# Altium schematic sheet Schéma bloc.SchDoc: =SchTitle
size 276 x 198 mm; Organization: ETML; Address1: Rue de Sébeillon12; Address2: CH - 1004 Lausanne; Address3: Tél. 021 316 77 77; Address4: www.etml.ch; SheetNumber: 1; SheetTotal: 4; Replace: .; ModA: .; ModB: .; ModC: .; ModD: .
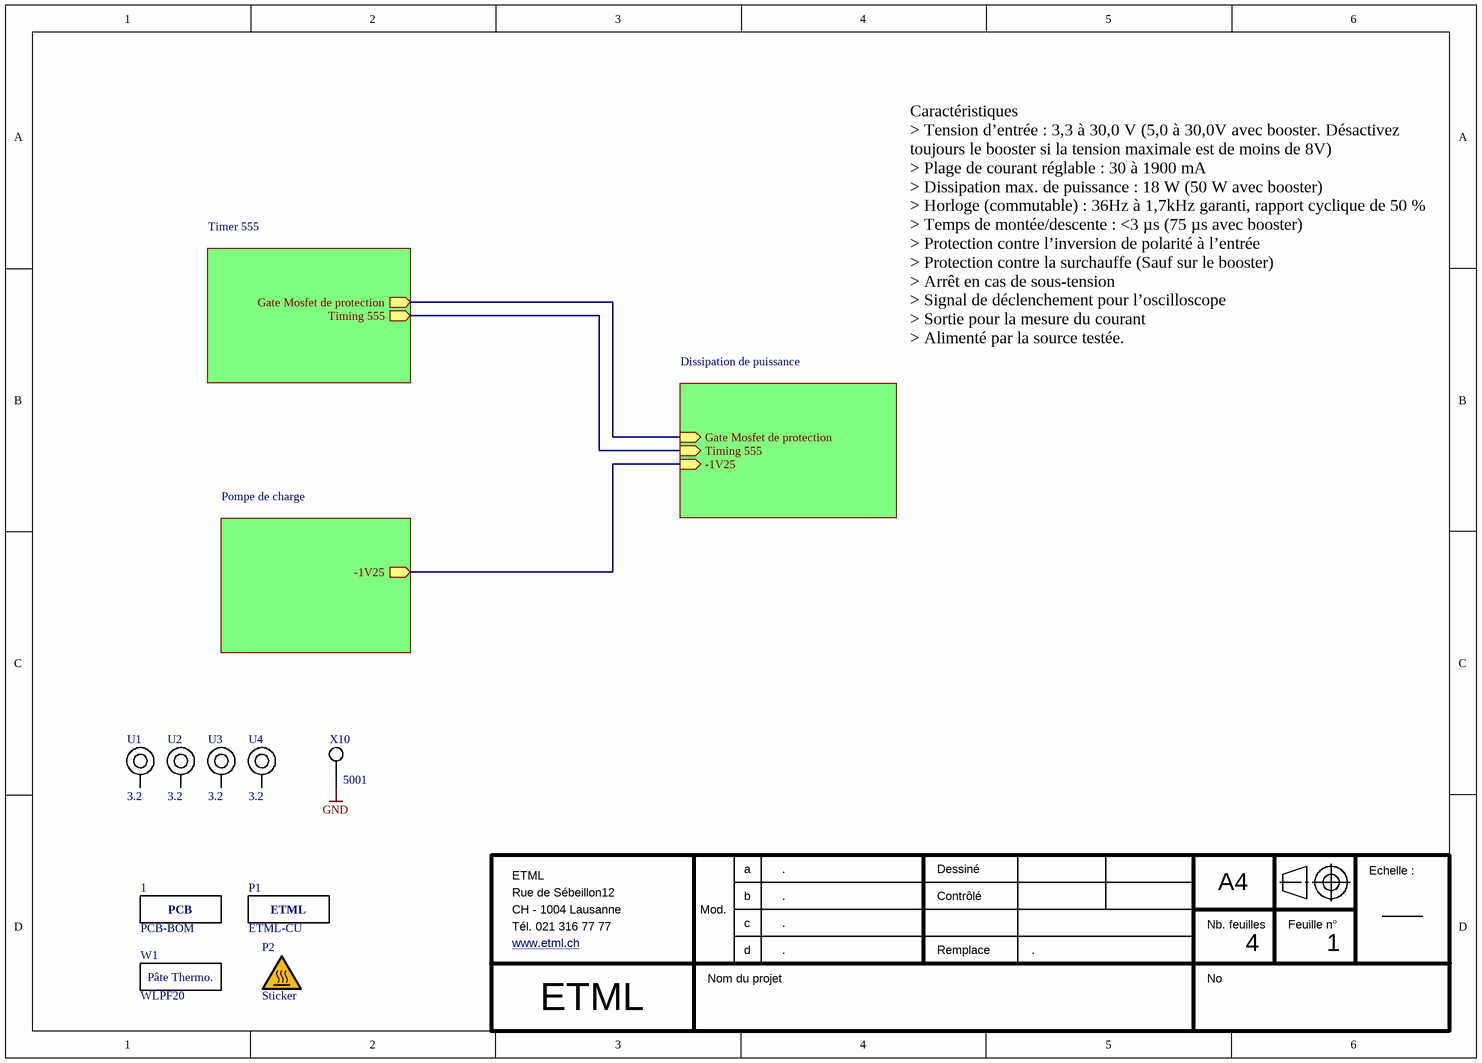
[diagram p0: Schéma bloc.SchDoc]

## Parts
1  PCB-BOM  (mechanical)
P1  ETML-CU  [DRAW-ETML-CU]  (no BOM)
P2  Sticker  [Sticker surface chaude]
U1  3.2  [MECH-PHD320]  (no BOM)
U2  3.2  [MECH-PHD320]  (no BOM)
U3  3.2  [MECH-PHD320]  (no BOM)
U4  3.2  [MECH-PHD320]  (no BOM)
W1  WLPF20
X10  5001  [Keystone_5001]

## Sub-sheets
Dissipation de puissance = Dissipation de puissance.SchDoc: Gate Mosfet de protection (in), Timing 555 (in), -1V25 (in)
Pompe de charge = Pompe de charge.SchDoc: -1V25 (out)
Timer 555 = Timer 555.SchDoc: Gate Mosfet de protection (out), Timing 555 (out)

## Nets
GND: X10.1(TP)
(unnamed): sheet Timer 555/Gate Mosfet de protection, sheet Dissipation de puissance/Gate Mosfet de protection
(unnamed): sheet Timer 555/Timing 555, sheet Dissipation de puissance/Timing 555
(unnamed): sheet Dissipation de puissance/-1V25, sheet Pompe de charge/-1V25

Not connected (* = marked no-connect by the designer): U1 1(PH); U2 1(PH); U3 1(PH); U4 1(PH)

## Notes on the sheet
- Caractéristiques
  > Tension d’entrée : 3,3 à 30,0 V (5,0 à 30,0V avec booster. Désactivez toujours le booster si la tension maximale est de moins de 8V)
  > Plage de courant réglable : 30 à 1900 mA
  > Dissipation max. de puissance : 18 W (50 W avec booster)
  > Horloge (commutable) : 36Hz à 1,7kHz garanti, rapport cyclique de 50 %
  > Temps de montée/descente : <3 µs (75 µs avec booster)
  > Protection contre l’inversion de polarité à l’entrée
  > Protection contre la surchauffe (Sauf sur le booster)
  > Arrêt en cas de sous-tension
  > Signal de déclenchement pour l’oscilloscope
  > Sortie pour la mesure du courant
  > Alimenté par la source testée.
- a
- Dessiné
- A4
- Echelle :
- Mod.
- b
- c
- d
- Contrôlé
- Remplace
- Nb. feuilles
- Feuille n°
- Nom du projet
- No
- (in symbol CMP-064-000000-1) ETML
- (in symbol CMP-064-000001-1) PCB
- (in symbol Graisse thermique) Pâte Thermo.

## Library data of the parts
1 = CMP-064-000001-1: PCB element for BOM; IsStocked: False; PN: 1438.5100.00; Category: Others; SubCategory: Dessins; Supplier Price 1: 52.05; Supplier 1: Eurocircuits Sàrl; Value: PCB-BOM; Supplier Part Number 1: E1595562
P1 = CMP-064-000000-1: Logo ETML; PN: PN-439033; IsStocked: False; Value: ETML-CU; SubCategory: Dessins; Category: Others
P2 = Sticker Surface chaude ISO7010: PIC W017-TRI 015-PE-SHEET/1; IsStocked: 1; PN: PIC W017-TRI 015-PE-SHEET/1; Supplier 1: Distrelec; Supplier Part Number 1: 302-20-433; Supplier Price 1: 0.246
U1-U4 = CMP-063-000019-1: Plated Hole  3.2mm; IsStocked: False; PN: PN-781782; SubCategory: Mecaniques; Value: 3.2; Category: Others
W1 = Graisse thermique: Pâte thermoconductrice 0.7W/mK 10ml WLPF20 Fischer elektronik; IsStocked: 1; PN: WLPF20; Supplier 1: ETML; Supplier Part Number 1: MAG 369.123; Supplier Price 1: 12.83
X10 = CMP-054-000003-1: TEST THT MINIATURE BK; Manufacturer: Keystone; PN: PN-688907; IsStocked: True; SubCategory: Testpoints; Supplier 1: ETML; Supplier Price 1: 0.26; Supplier Part Number 1: MAG.428.011; Category: Connectors; Manufacturer Number: 5001; Value: 5001